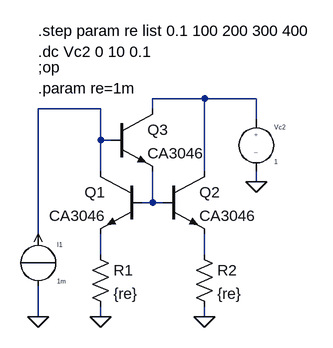
[diagram p0: schematic stromspiegel_widlar.asc]
stromspiegel_widlar.asc, the LTspice schematic file:
Version 4
SHEET 1 880 680
WIRE 304 48 224 48
WIRE 384 48 304 48
WIRE 144 64 48 64
WIRE 224 64 224 48
WIRE 384 80 384 48
WIRE 144 112 144 64
WIRE 160 112 144 112
WIRE 144 160 144 112
WIRE 304 160 304 48
WIRE 384 176 384 160
WIRE 224 208 224 160
WIRE 224 208 208 208
WIRE 240 208 224 208
WIRE 48 256 48 64
WIRE 144 288 144 256
WIRE 304 288 304 256
WIRE 48 384 48 336
WIRE 144 384 144 368
WIRE 304 384 304 368
FLAG 144 384 0
FLAG 304 384 0
FLAG 48 384 0
FLAG 384 176 0
SYMBOL EIT_Semiconductors\\npn 240 160 R0
SYMATTR InstName Q2
SYMATTR Value CA3046
SYMBOL EIT_Semiconductors\\npn 208 160 M0
SYMATTR InstName Q1
SYMATTR Value CA3046
SYMBOL res 128 272 R0
SYMATTR InstName R1
SYMATTR Value {re}
SYMBOL res 288 272 R0
SYMATTR InstName R2
SYMATTR Value {re}
SYMBOL source-I 48 256 R0
SYMATTR InstName I1
SYMATTR Value 1m
SYMBOL source-V 384 64 R0
SYMATTR InstName Vc2
SYMATTR Value 1
SYMBOL EIT_Semiconductors\\npn 160 64 R0
SYMATTR InstName Q3
SYMATTR Value CA3046
TEXT 48 0 Left 2 !;op
TEXT 48 32 Left 2 !.param re=1m
TEXT 48 -24 Left 2 !.dc Vc2 0 10 0.1
TEXT 48 -56 Left 2 !.step param re list 0.1 100 200 300 400

The netlist it stands for:
* stromspiegel_widlar.asc
Q2 N001 N003 N005 0 CA3046
Q1 N002 N003 N004 0 CA3046
R1 N004 0 {re}
R2 N005 0 {re}
I1 0 N002 1m
Vc2 N001 0 1
Q3 N001 N002 N003 0 CA3046
.model NPN NPN
.model PNP PNP
.lib standard.bjt
;op
.param re=1m
.dc Vc2 0 10 0.1
.step param re list 0.1 100 200 300 400
.backanno
.end